# EAGLE board BasePCB (EAGLE 9.4.2), part 1 of 2
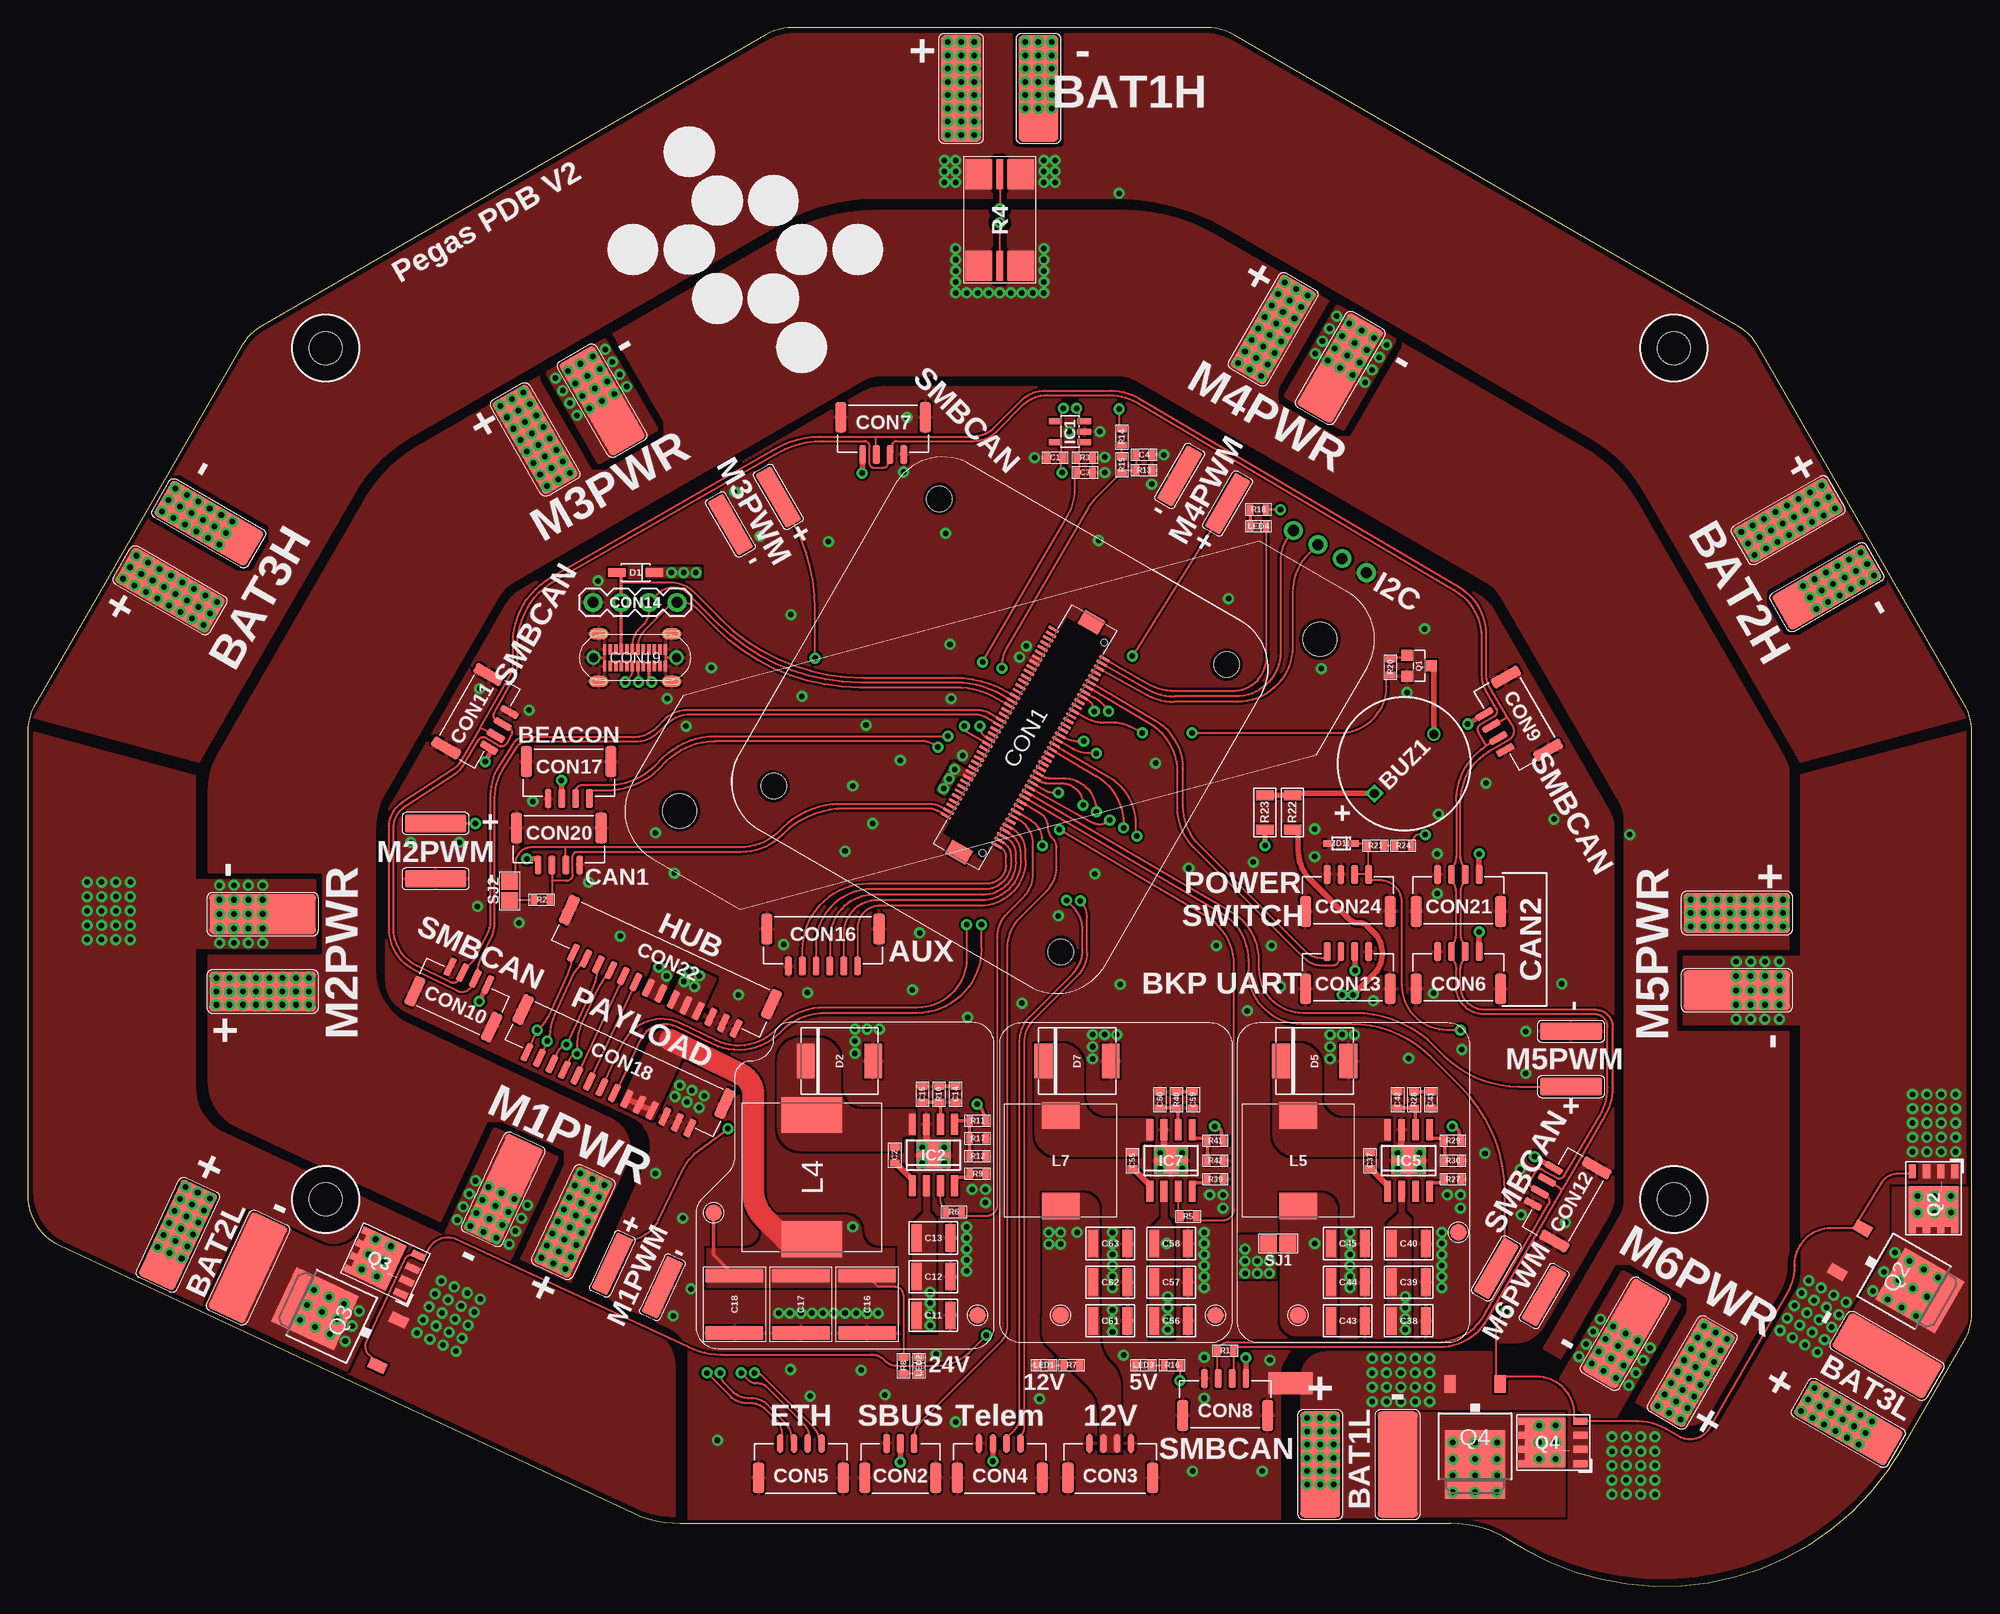
[diagram p3: board, top side]
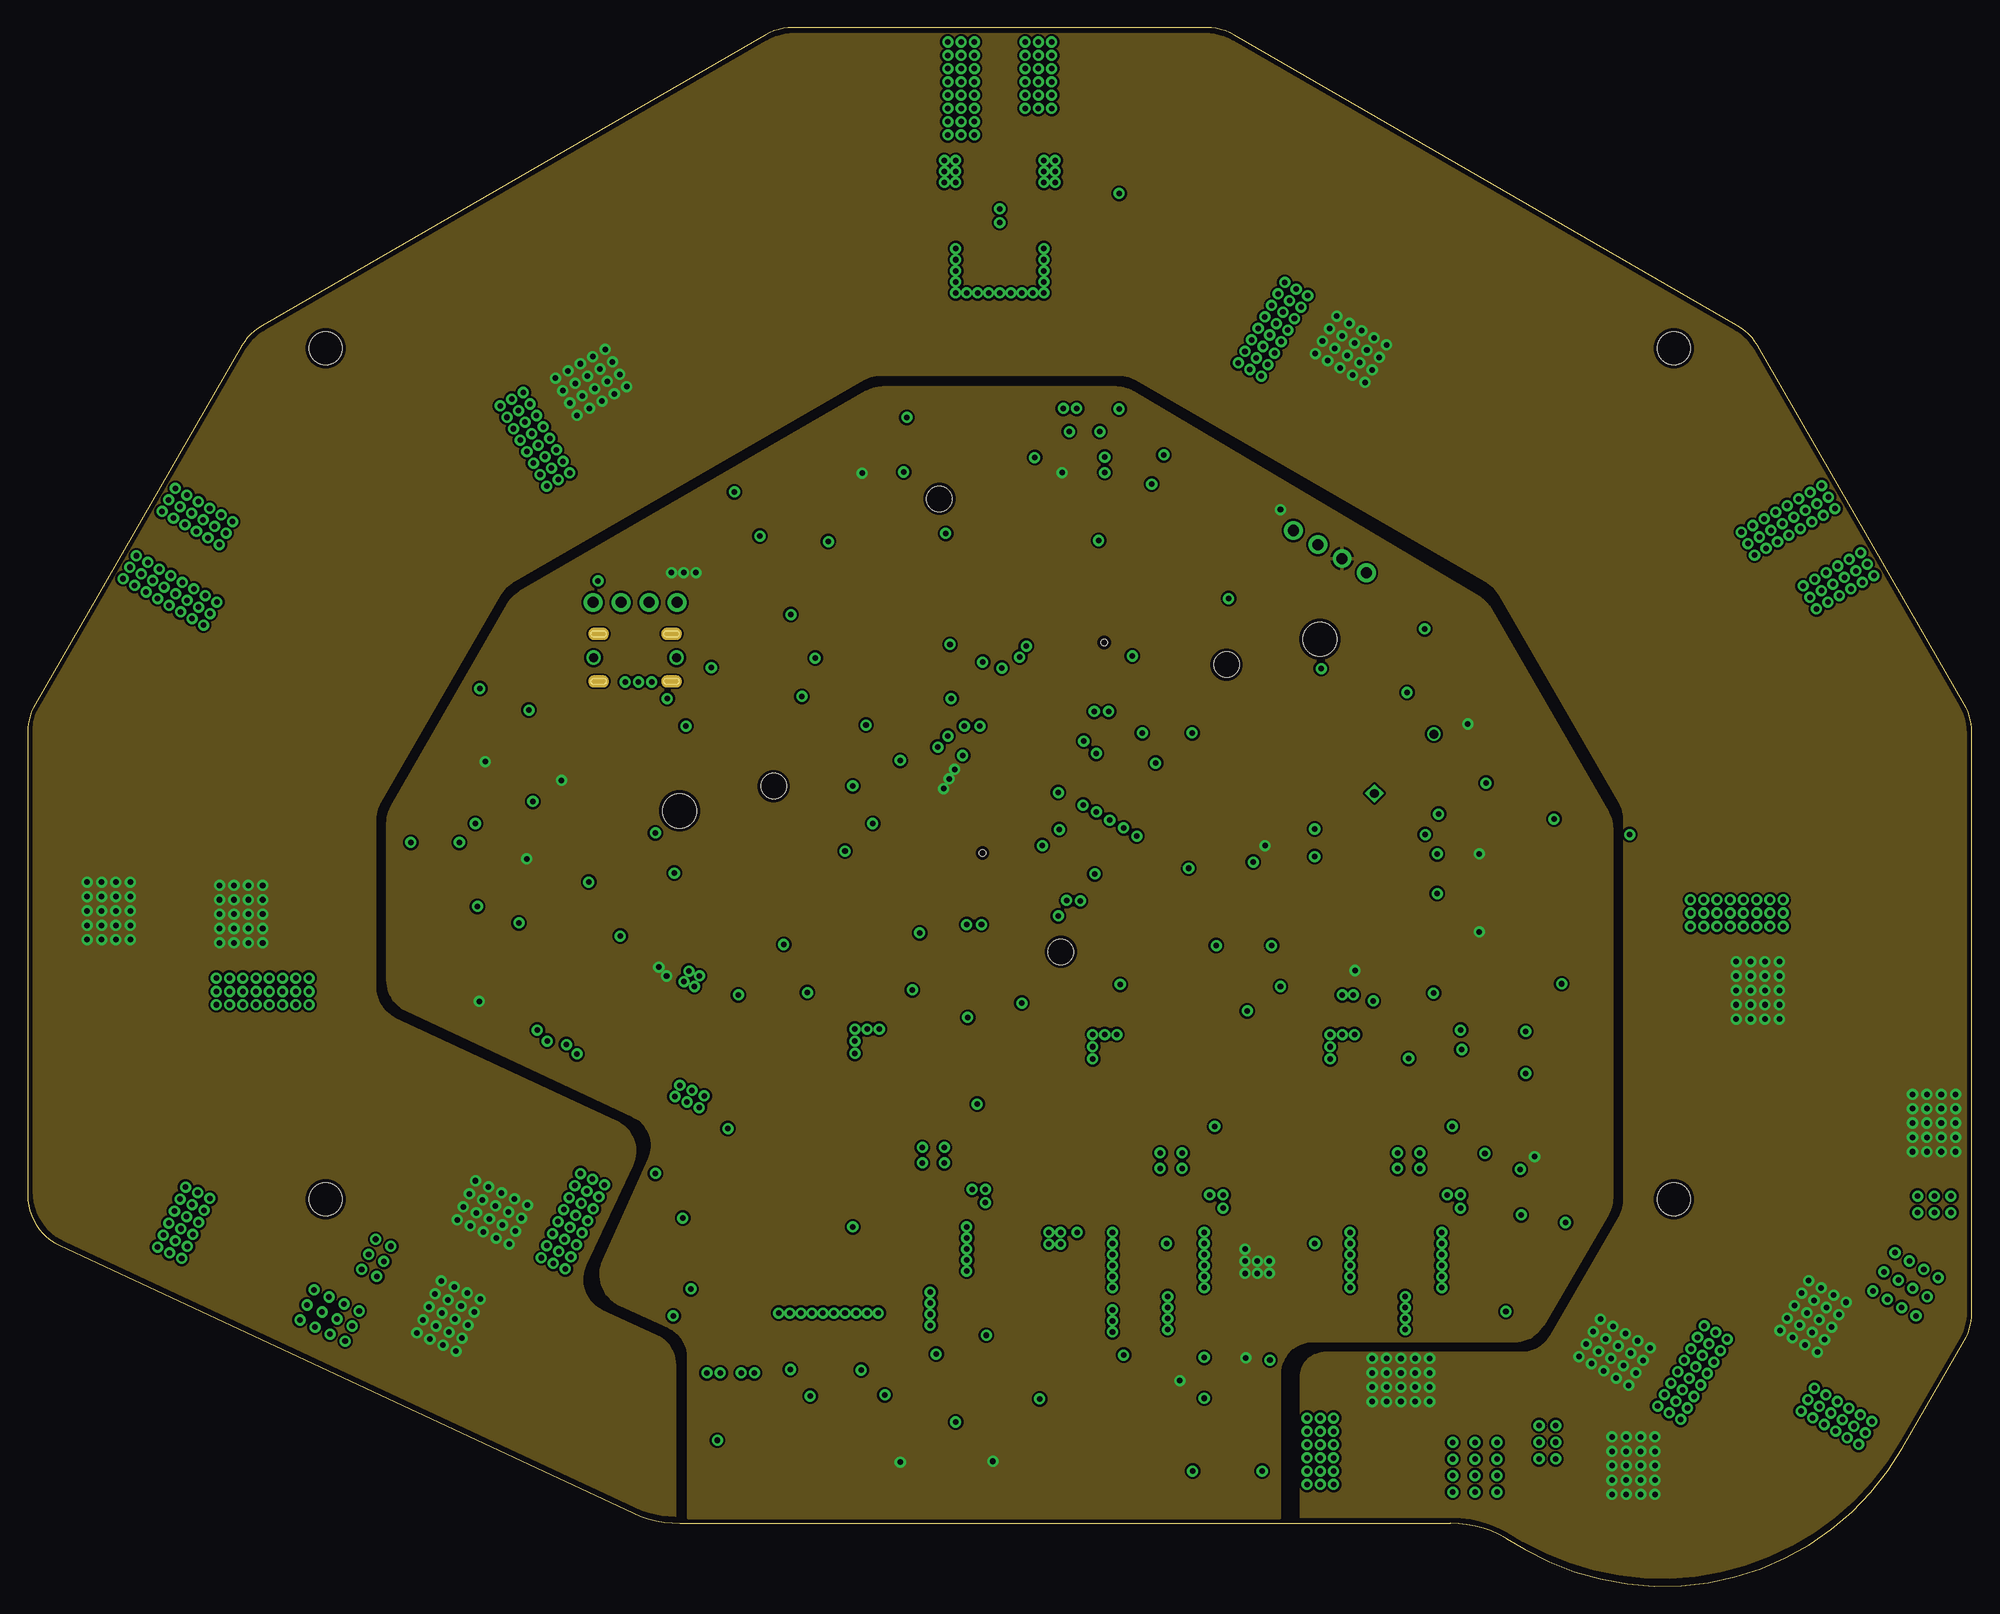
[diagram p4: board, inner layer Route2]
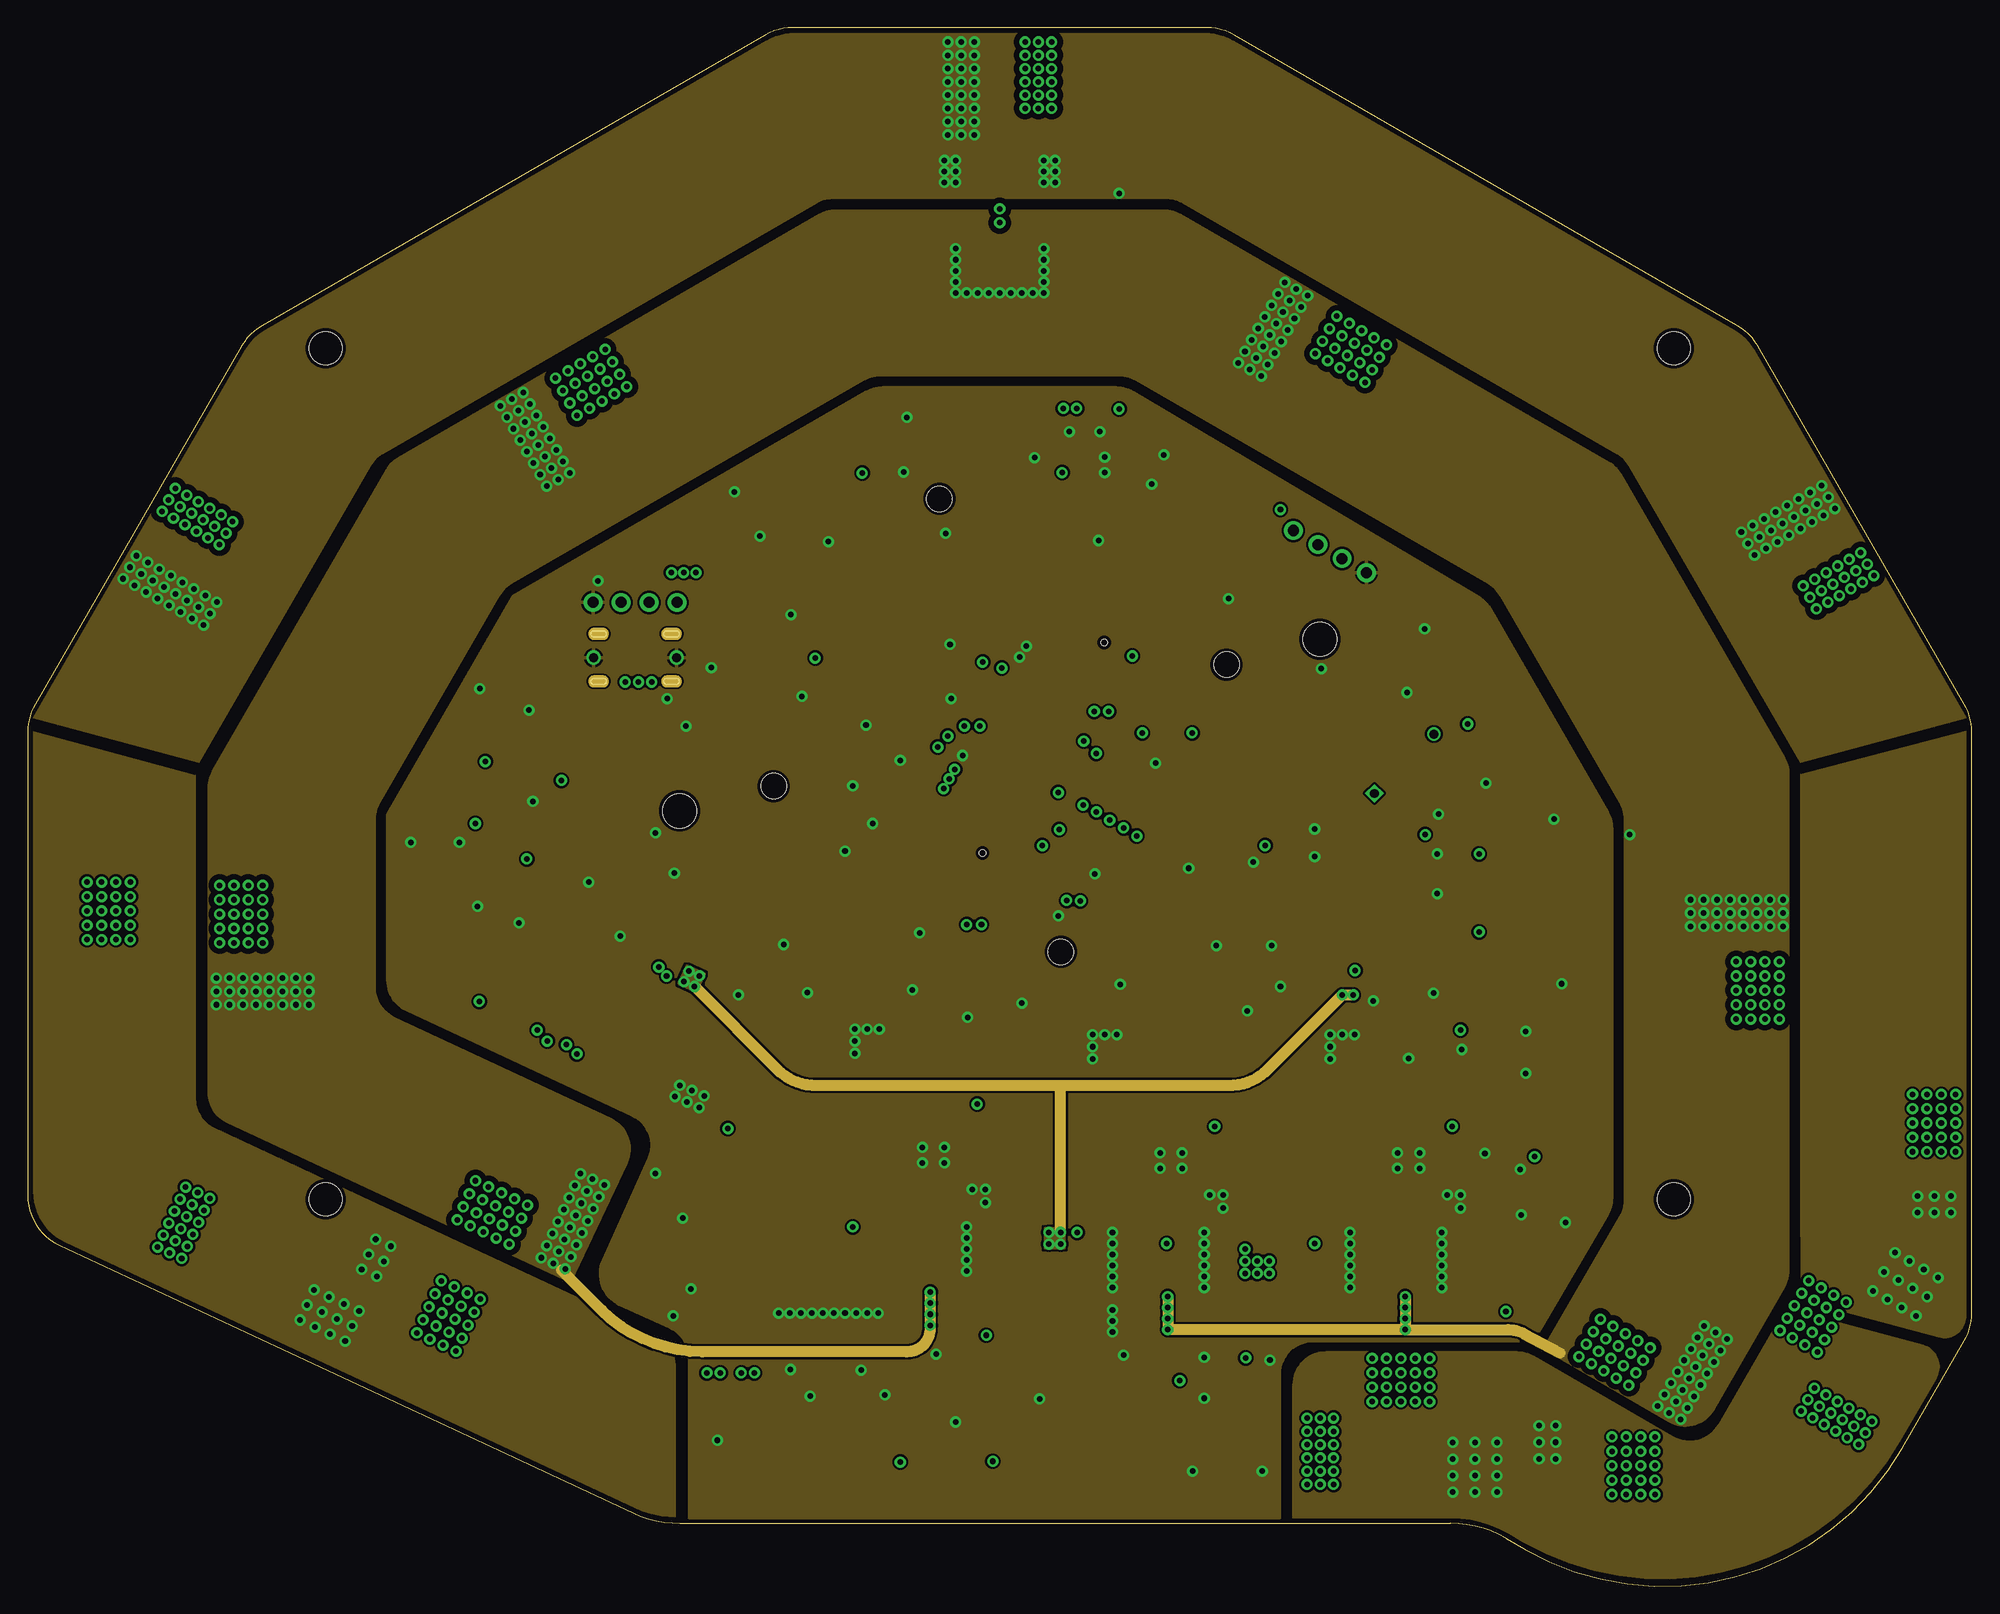
[diagram p5: board, inner layer Route3]
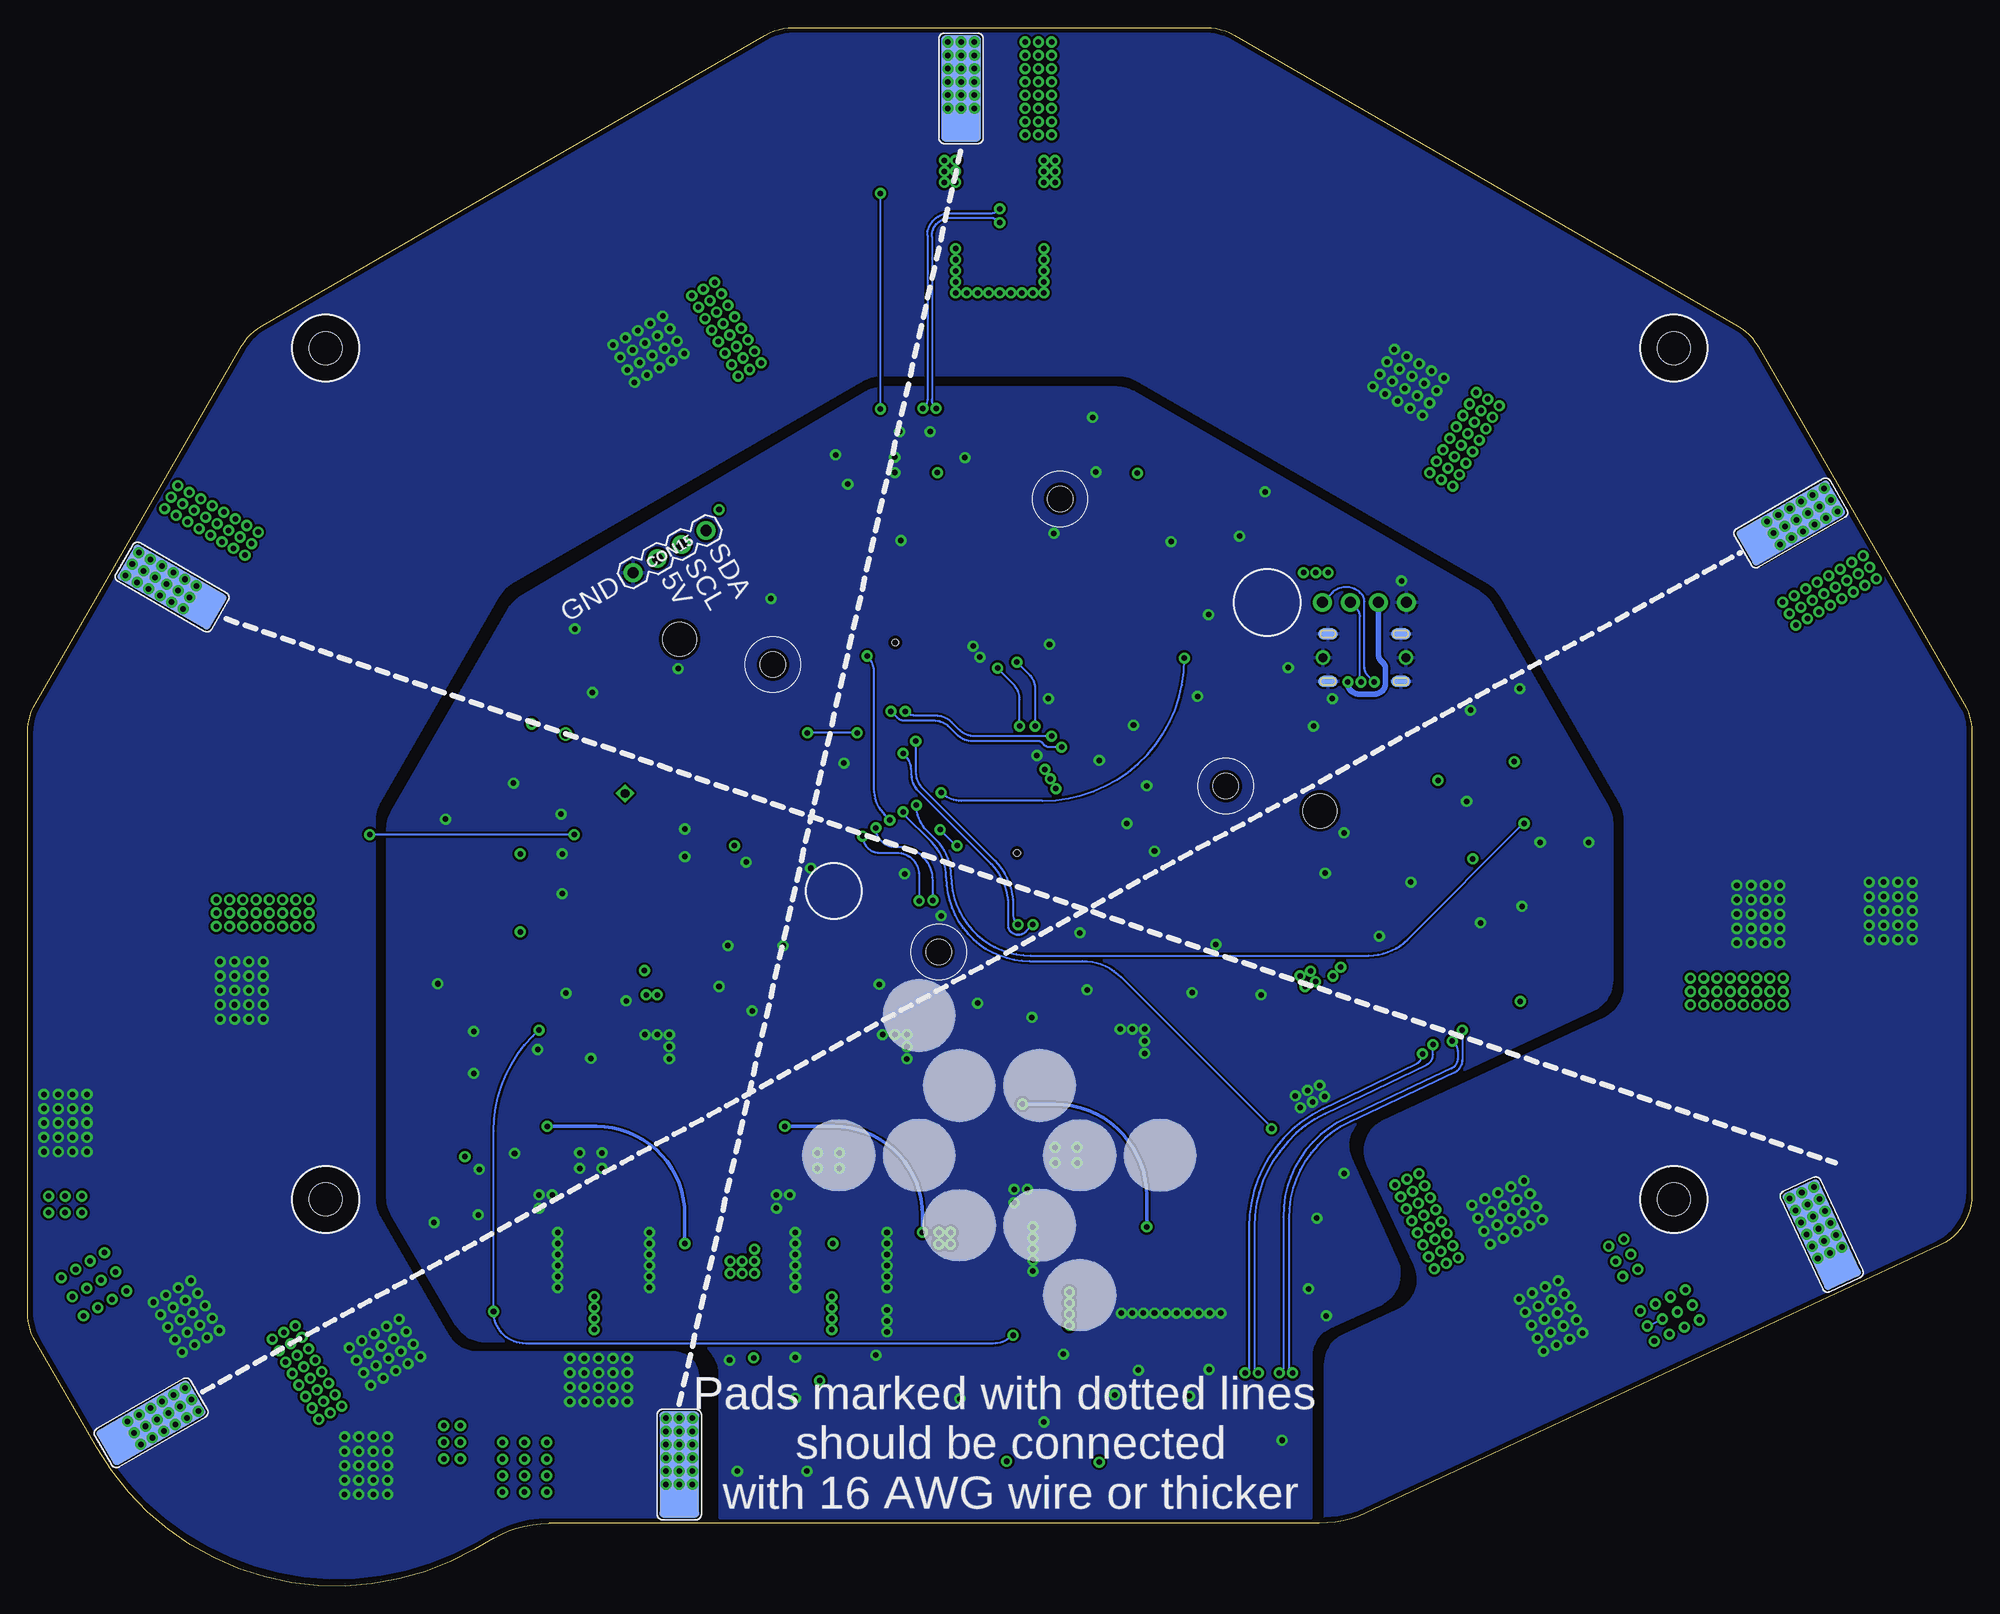
[diagram p6: board, bottom side, seen from below]

Size 175.94 x 140.99 mm. Coordinates in mm from the lower left corner, seen from the top.
Outline: 133.77,4.34 135.51,3.34 arc90 169.66,12.49 175.27,22.2 arc30 175.94,24.7 175.94,77.28 arc30 175.27,79.78 156.55,112.2 arc30 154.72,114.03 109.19,140.32 arc30 106.69,140.99 69.25,140.99 arc30 66.75,140.32 21.22,114.03 arc30 19.39,112.2 0.67,79.78 arc30 0,77.28 0,35.36 arc65 2.89,30.82 54.8,6.62 arc25 59.03,5.68 128.77,5.68 arc-30 133.77,4.34
Copper layers (1+2*3+16): Top 0.035mm / dielectric 0.12mm / Route2 0.035mm / dielectric 1.2mm / Route3 0.035mm / dielectric 0.2mm / Bottom 0.035mm
Design rules "JLCPCB 4 layer_0.2 *": minimum track width 0.2mm, minimum drill 0.2mm, track to track 0.2mm, track to pad 0.2mm, pad to pad 0.2mm, via to via 0.2mm, smd to smd 0.15mm, copper to edge 0.3mm, drill to drill 0.2mm, minimum pad ring 0.125mm, minimum via ring 0.125mm, stop-mask expansion 1mil, vias tented up to drill 0.5mm, thermal gap 8mil
Net classes: 1 HV: clearance 0.5 mm to class 0, clearance 0.5 mm
Holes 3 mm at 148.97,111.99 26.97,111.99 26.97,34.99 148.97,34.99
tRestrict: area 24,32 to 30,38; area 146,32 to 152,38; area 146,109 to 152,115; area 24,109 to 30,115; 3 lines
bRestrict: area 24,109 to 30,115; area 24,32 to 30,38; area 146,32 to 152,38; area 146,109 to 152,115

## Footprints (pad centres in the part's own frame; a part is rotated, then mirrored left to right if it is on the bottom)
4X10_PAIR = smd 3.6 x 9.6: 1 -3.5,0; 2 3.5,0
BUZZER_12MM = drill 0.8 pad 1.2 square: 1 -3.8,0 | drill 0.8 pad 1.2: 2 3.8,0
C0603 = smd 0.6 x 0.9: 1 -0.725,0; 2 0.725,0
C1210 = smd 0.9 x 2.5: 1 -1.55,0; 2 1.55,0
C2220 = smd 1.2 x 5.2: P$1 -2.6,0; P$2 2.6,0
CUBE_ORANGE = smd 0.25 x 1: 1 9.75,2.65; 2 9.75,-2.65; 3 9.25,2.65; 4 9.25,-2.65; 5 8.75,2.65; 6 8.75,-2.65; 7 8.25,2.65; 8 8.25,-2.65; 9 7.75,2.65; 10 7.75,-2.65; 11 7.25,2.65; 12 7.25,-2.65; 13 6.75,2.65; 14 6.75,-2.65; 15 6.25,2.65; 16 6.25,-2.65; 17 5.75,2.65; 18 5.75,-2.65; 19 5.25,2.65; 20 5.25,-2.65; 21 4.75,2.65; 22 4.75,-2.65; 23 4.25,2.65; 24 4.25,-2.65; 25 3.75,2.65; 26 3.75,-2.65; 27 3.25,2.65; 28 3.25,-2.65; 29 2.75,2.65; 30 2.75,-2.65; 31 2.25,2.65; 32 2.25,-2.65; 33 1.75,2.65; 34 1.75,-2.65; 35 1.25,2.65; 36 1.25,-2.65; 37 0.75,2.65; 38 0.75,-2.65; 39 0.25,2.65; 40 0.25,-2.65; 41 -0.25,2.65; 42 -0.25,-2.65; 43 -0.75,2.65; 44 -0.75,-2.65; 45 -1.25,2.65; 46 -1.25,-2.65; 47 -1.75,2.65; 48 -1.75,-2.65; 49 -2.25,2.65; 50 -2.25,-2.65; 51 -2.75,2.65; 52 -2.75,-2.65; 53 -3.25,2.65; 54 -3.25,-2.65; 55 -3.75,2.65; 56 -3.75,-2.65; 57 -4.25,2.65; 58 -4.25,-2.65; 59 -4.75,2.65; 60 -4.75,-2.65; 61 -5.25,2.65; 62 -5.25,-2.65; 63 -5.75,2.65; 64 -5.75,-2.65; 65 -6.25,2.65; 66 -6.25,-2.65; 67 -6.75,2.65; 68 -6.75,-2.65; 69 -7.25,2.65; 70 -7.25,-2.65; 71 -7.75,2.65; 72 -7.75,-2.65; 73 -8.25,2.65; 74 -8.25,-2.65; 75 -8.75,2.65; 76 -8.75,-2.65; 77 -9.25,2.65; 78 -9.25,-2.65; 79 -9.75,2.65; 80 -9.75,-2.65 | smd 1.4 x 2.1: P1 -12,0; P2 12,0 | hole 0.6: -11,-1.9; 11,-1.9 | hole 2.3: -15.2,17.5; 14.8,17.5; 14.8,-12.5; -15.2,-12.5
SM03B-GHS-TB = smd 0.6 x 1.7: 1 1.25,-2.91; 2 0,-2.91; 3 -1.25,-2.91 | smd 1 x 2.8: M$0 -3.2,0.19; M$1 3.2,0.19
SM04B-GHS-TB = smd 0.6 x 1.7: 1 1.875,-2.91; 2 0.625,-2.91; 3 -0.625,-2.91; 4 -1.875,-2.91 | smd 1 x 2.8: M$0 -3.825,0.19; M$1 3.825,0.19
BM04B-GHS-TB = smd 0.6 x 1.7: 1 -1.875,-2.9; 2 -0.625,-2.9; 3 0.625,-2.9; 4 1.875,-2.9 | smd 1 x 2.8: M$0 -3.825,0.45; M$1 3.825,0.45
1X04-PTH-2.54 = drill 1 pad 1.7: 1 -3.81,0; 2 -1.27,0; 3 1.27,0; 4 3.81,0
BM06B-GHS-TBT = smd 0.6 x 1.7: 1 -3.125,-2.9; 2 -1.875,-2.9; 3 -0.625,-2.9; 4 0.625,-2.9; 5 1.875,-2.9; 6 3.125,-2.9 | smd 1 x 2.8: M$0 -5.075,0.45; M$1 5.075,0.45
BM14B-GHS-TBT = smd 0.6 x 1.7: 1 -8.125,-2.9; 2 -6.875,-2.9; 3 -5.625,-2.9; 4 -4.375,-2.9; 5 -3.125,-2.9; 6 -1.875,-2.9; 7 -0.625,-2.9; 8 0.625,-2.9; 9 1.875,-2.9; 10 3.125,-2.9; 11 4.375,-2.9; 12 5.625,-2.9; 13 6.875,-2.9; 14 8.125,-2.9 | smd 1 x 2.8: M$0 -10.075,0.45; M$1 10.075,0.45
2047110001-PROD = smd 0.3 x 0.95: A1 -2.75,0.755; A2 -2.25,0.755; A3 -1.75,0.755; A4 -1.25,0.755; A5 -0.75,0.755; A6 -0.25,0.755; A7 0.25,0.755; A8 0.75,0.755; A9 1.25,0.755; A10 1.75,0.755; A11 2.25,0.755; A12 2.75,0.755; B1 2.75,-0.755; B2 2.25,-0.755; B3 1.75,-0.755; B4 1.25,-0.755; B5 0.75,-0.755; B6 0.25,-0.755; B7 -0.25,-0.755; B8 -0.75,-0.755; B9 -1.25,-0.755; B10 -1.75,-0.755; B11 -2.25,-0.755; B12 -2.75,-0.755 | smd 1.8 x 1: G1 -3.3,2.15; G4 3.3,2.15; G7 -3.3,-2.15; G9 3.3,-2.15 | smd 1.8 x 1 bottom: G2 -3.3,2.15; G5 3.3,2.15; G8 -3.3,-2.15; G10 3.3,-2.15 | drill 0.8 pad 1.3: P$1 -3.75,0; P$2 3.75,0
SOD123 = smd 1.6 x 0.8: A -1.7,0; C 1.7,0
DO-214AB(SMC) = smd 1.6 x 3.1: A 3.05,0; C -3.05,0
SOT23-5 = smd 1.2 x 0.55: 1 1.3,-0.95; 2 1.3,0; 3 1.3,0.95; 4 -1.3,0.95; 5 -1.3,-0.95
SOIC8-POWERPAD = smd 0.6 x 1.9: 1 -1.905,-2.78; 2 -0.635,-2.78; 3 0.635,-2.78; 4 1.905,-2.78; 5 1.905,2.78; 6 0.635,2.78; 7 -0.635,2.78; 8 -1.905,2.78 | smd 3.1 x 2.4: P$1 0,0
CONNECTION_BIG = smd 2 x 2: 1 -1,0; 2 1,0
MWSA1206S = smd 3.25 x 5.5: 1 -5.625,0; 2 5.625,0
1064 = smd 3.4 x 2.4: 1 0,-4.1; 2 0,4.1
LED0603 = smd 0.6 x 0.9: A 0.725,0; C -0.725,0
10X4 = smd 3.6 x 9.6: P$1 0,0
2х2 = smd 1.5 x 1.5: P$1 0,0
2X6_PAIR = smd 1.6 x 5.6: 1 -2.5,0; 2 2.5,0
SOT23 = smd 1 x 1: 1 1.1,-0.95; 2 1.1,0.95; 3 -1.1,0
D-PAK = smd 5.4 x 6.2: D 0,2.5 | smd 1 x 1.6: G -2.28,-4.8; S 2.28,-4.8
PG-TDSON-8 = smd 1.27 x 0.635: 1S -2.54,1.905; 2S -2.54,0.635; 3S -2.54,-0.635; 4G -2.54,-1.905 | smd 1.02 x 0.635: 5D 2.54,-1.905; 6D 2.54,-0.635; 7D 2.54,0.635; 8D 2.54,1.905 | smd 3.678 x 4.445: PAD_D 0.66,-0.003
R0603 = smd 0.6 x 0.9: 1 -0.725,0; 2 0.725,0
R3920-KELVIN = smd 2.7 x 2.4: 1 -4.15,1.9; 2 4.15,1.9; 11 -4.15,-1.9; 22 4.15,-1.9 | smd 2.7 x 0.6: S1 -4.15,0; S2 4.15,0
R1206 = smd 0.9 x 1.6: P$1 -1.55,0; P$2 1.55,0
RES_0 = smd 1.5 x 1.5: 1 -0.85,0; 2 0.85,0
CUBE_MOUNT = hole 3.1: -30,0; 30,0
SOD323 = smd 1 x 0.6: A 1.1,0; C -1.1,0

## Placement (x,y rotation side)
BAT1PAD1  PAD_PAIR-4X10  [4X10_PAIR]  87.97,135.49 0 top
BAT1PAD2  PAD_PAIR-4X10  [4X10_PAIR]  120.47,10.99 0 top
BAT2PAD1  PAD_PAIR-4X10  [4X10_PAIR]  161.06,93.4 300 top
BAT2PAD2  PAD_PAIR-4X10  [4X10_PAIR]  16.77,30.29 335 top
BAT3PAD1  PAD_PAIR-4X10  [4X10_PAIR]  14.64,93.12 60 top
BAT3PAD2  PAD_PAIR-4X10  [4X10_PAIR]  166.51,17.8 60 top
BUZ1  BUZZER-ЕР-12MM  [BUZZER_12MM]  124.57,74.39 45 top
C1  0.1uF  [C0603]  92.97,102.09 0 top
C2  0.1uF  [C0603]  78.47,38.99 90 top
C3  DNP  [C0603]  95.67,100.74 180 top
C4  DNP  [C0603]  101.02,102.34 180 top
C11  2.2uF  [C1210]  81.97,24.49 180 top
C12  2.2uF  [C1210]  81.97,27.99 180 top
C13  2.2uF  [C1210]  81.97,31.49 180 top
C14  4700pF  [C0603]  83.97,44.49 90 top
C15  47pF  [C0603]  80.97,44.49 270 top
C16  22uF  [C2220]  75.97,25.49 90 top
C17  22uF  [C2220]  69.97,25.49 90 top
C18  22uF  [C2220]  63.97,25.49 90 top
C37  0.1uF  [C0603]  121.47,38.49 90 top
C38  2.2uF  [C1210]  124.97,23.99 180 top
C39  2.2uF  [C1210]  124.97,27.49 180 top
C40  2.2uF  [C1210]  124.97,30.99 180 top
C41  4700pF  [C0603]  126.97,43.99 90 top
C42  47pF  [C0603]  123.97,43.99 270 top
C43  47uF  [C1210]  119.47,23.99 180 top
C44  47uF  [C1210]  119.47,27.49 180 top
C45  47uF  [C1210]  119.47,30.99 180 top
C55  0.1uF  [C0603]  99.97,38.49 90 top
C56  2.2uF  [C1210]  103.47,23.99 180 top
C57  2.2uF  [C1210]  103.47,27.49 180 top
C58  2.2uF  [C1210]  103.47,30.99 180 top
C59  4700pF  [C0603]  105.47,43.99 90 top
C60  47pF  [C0603]  102.47,43.99 270 top
C61  47uF  [C1210]  97.97,23.99 180 top
C62  47uF  [C1210]  97.97,27.49 180 top
C63  47uF  [C1210]  97.97,30.99 180 top
CON1  CUBE_ORANGE_  [CUBE_ORANGE]  90.27,76.79 60 top
CON2  CON-3P-TABS-JST-GH-SIDE  [SM03B-GHS-TB]  78.97,9.99 180 top
CON3  CON-4P-TABS-JST-GH-SIDE  [SM04B-GHS-TB]  97.97,9.99 180 top
CON4  CON-4P-TABS-JST-GH-SIDE  [SM04B-GHS-TB]  87.97,9.99 180 top
CON5  CON-4P-TABS-JST-GH-SIDE  [SM04B-GHS-TB]  69.97,9.99 180 top
CON6  CON-4P-TABS-JST-GH-TOP  [BM04B-GHS-TB]  129.47,54.49 180 top
CON7  CON-4P-TABS-JST-GH-TOP  [BM04B-GHS-TB]  77.42,105.29 0 top
CON8  CON-4P-TABS-JST-GH-TOP  [BM04B-GHS-TB]  108.37,15.89 180 top
CON9  CON-4P-TABS-JST-GH-TOP  [BM04B-GHS-TB]  135.29,78.71 300 top
CON10  CON-4P-TABS-JST-GH-TOP  [BM04B-GHS-TB]  38.71,52.61 155 top
CON11  CON-4P-TABS-JST-GH-TOP  [BM04B-GHS-TB]  40.17,78.92 60 top
CON12  CON-4P-TABS-JST-GH-TOP  [BM04B-GHS-TB]  139.67,34.74 240 top
CON13  CON-4P-TABS-JST-GH-TOP  [BM04B-GHS-TB]  119.47,54.49 180 top
CON14  PINHEAD_1X04-2.54  [1X04-PTH-2.54]  54.97,88.99 0 top
CON15  PINHEAD_1X04-2.54  [1X04-PTH-2.54]  117.85,93.59 30 bottom
CON16  CON-6P-TABS-JST-GH-TOP  [BM06B-GHS-TBT]  71.97,58.99 0 top
CON17  CON-4P-TABS-JST-GH-TOP  [BM04B-GHS-TB]  48.97,74.14 0 top
CON18  CON-14P-TABS-JST-GH-TOP  [BM14B-GHS-TBT]  53.77,47.49 335 top
CON19  USB-TYPE-C-VERT-PROD  [2047110001-PROD]  54.97,83.99 0 top
CON20  CON-4P-TABS-JST-GH-TOP  [BM04B-GHS-TB]  48.07,68.14 0 top
CON21  CON-4P-TABS-JST-GH-TOP  [BM04B-GHS-TB]  129.47,61.49 180 top
CON22  CON-14P-TABS-JST-GH-TOP  [BM14B-GHS-TBT]  57.97,56.49 335 top
CON24  CON-4P-TABS-JST-GH-TOP  [BM04B-GHS-TB]  119.47,61.49 180 top
D1  MBR0520L-SOD123  [SOD123]  55.02,91.69 0 top
D2  B560C  [DO-214AB(SMC)]  73.47,47.49 0 top
D5  B560C  [DO-214AB(SMC)]  116.47,47.49 0 top
D7  B560C  [DO-214AB(SMC)]  94.97,47.49 0 top
IC1  INA169  [SOT23-5]  94.32,104.44 0 top
IC2  TPS54560B  [SOIC8-POWERPAD]  81.97,38.99 0 top
IC5  TPS54560B  [SOIC8-POWERPAD]  124.97,38.49 0 top
IC7  TPS54560B  [SOIC8-POWERPAD]  103.47,38.49 0 top
J1  CONNECTION-SMD-BIG  [CONNECTION_BIG]  114.27,18.34 0 top
L4  22µH  [MWSA1206S]  70.97,36.99 270 top
L5  7.2uH  [1064]  114.97,38.49 180 top
L7  7.2uH  [1064]  93.47,38.49 180 top
LED1  LED-0603  [LED0603]  91.97,19.99 0 top
LED2  LED-0603  [LED0603]  80.67,19.94 270 top
LED3  LED-0603  [LED0603]  100.97,19.99 0 top
LED4  LED-0603  [LED0603]  111.37,95.89 180 top
M1  PAD_PAIR-4X10  [4X10_PAIR]  46.21,34.41 155 top
M2  PAD_PAIR-4X10  [4X10_PAIR]  21.27,57.29 90 top
M3  PAD_PAIR-4X10  [4X10_PAIR]  48.96,105.49 30 top
M4  PAD_PAIR-4X10  [4X10_PAIR]  115.74,111.94 330 top
M5  PAD_PAIR-4X10  [4X10_PAIR]  154.67,57.39 270 top
M6  PAD_PAIR-4X10  [4X10_PAIR]  147.61,21.08 150 top
PAD1  PAD-10X4  [10X4]  91.47,135.49 0 bottom
PAD2  PAD-10X4  [10X4]  13.6,31.8 25 bottom
PAD5  PAD-10X4  [10X4]  162.86,90.38 240 bottom
PAD6  PAD-10X4  [10X4]  164.76,14.77 300 bottom
PAD7  PAD-10X4  [10X4]  116.97,10.99 0 bottom
PAD10  PAD-10X4  [10X4]  16.39,96.18 300 bottom
PAD13  PAD-S_2X2  [2х2]  129.47,31.99 90 top
PAD14  PAD-S_2X2  [2х2]  114.97,24.49 90 top
PAD15  PAD-S_2X2  [2х2]  93.47,24.49 90 top
PAD16  PAD-S_2X2  [2х2]  107.47,24.49 180 top
PAD17  PAD-S_2X2  [2х2]  62.07,33.79 180 top
PAD18  PAD-S_2X2  [2х2]  85.97,24.49 90 top
PAD28  PAD_PAIR-2X6  [2X6_PAIR]  55.17,28.09 155 top
PAD29  PAD_PAIR-2X6  [2X6_PAIR]  36.92,66.49 90 top
PAD30  PAD_PAIR-2X6  [2X6_PAIR]  65.77,97.29 30 top
PAD31  PAD_PAIR-2X6  [2X6_PAIR]  106.42,99.19 330 top
PAD32  PAD_PAIR-2X6  [2X6_PAIR]  139.67,47.69 270 top
PAD33  PAD_PAIR-2X6  [2X6_PAIR]  135.07,27.49 150 top
Q1  IRLML0030  [SOT23]  125.92,83.24 180 top
Q2  IRFR2407PBF  [D-PAK]  169.07,27.99 240 top
Q2_  IRFH5010TRPBF-DFN5X6  [PG-TDSON-8]  172.47,34.99 270 top
Q3  IRFR2407PBF  [D-PAK]  28.27,24.04 65 top
Q3_  IRFH5010TRPBF-DFN5X6  [PG-TDSON-8]  32.27,29.25 155 top
Q4  IRFR2407PBF  [D-PAK]  130.97,13.49 180 top
Q4_  IRFH5010TRPBF-DFN5X6  [PG-TDSON-8]  137.97,12.99 180 top
R1  120R  [R0603]  108.37,21.29 180 top
R2  120R  [R0603]  46.52,62.09 180 top
R3  82K  [R0603]  95.67,102.09 180 top
R4  200 µOhms  [R3920-KELVIN]  87.97,123.59 270 top
R5  DNP  [R0603]  105.02,33.44 180 top
R6  DNP  [R0603]  83.82,33.84 180 top
R7  3K3  [R0603]  94.47,19.99 180 top
R8  7K5  [R0603]  79.27,19.94 270 top
R9  243K  [R0603]  85.97,37.29 180 top
R10  16K  [R0603]  82.47,44.49 270 top
R11  143K  [R0603]  85.97,42.09 0 top
R12  10K2  [R0603]  85.97,38.89 180 top
R13  10K2  [R0603]  101.02,100.94 180 top
R14  82K  [R0603]  99.02,103.94 90 top
R15  82K  [R0603]  99.02,101.44 90 top
R16  1K  [R0603]  103.57,19.99 180 top
R17  10K2  [R0603]  85.97,40.49 180 top
R18  1K  [R0603]  111.37,97.39 180 top
R20  200R  [R0603]  123.32,83.14 270 top
R21  143K  [R0603]  121.97,66.99 180 top
R22  200R  [R1206]  114.47,69.99 270 top
R23  DNM  [R1206]  111.97,69.99 270 top
R24  143K  [R0603]  124.47,66.99 180 top
R27  243K  [R0603]  128.97,36.79 180 top
R28  16K  [R0603]  125.47,43.99 270 top
R29  53K6  [R0603]  128.97,40.29 0 top
R30  10K2  [R0603]  128.97,38.49 180 top
R39  243K  [R0603]  107.47,36.79 180 top
R40  16K  [R0603]  103.97,43.99 270 top
R41  143K  [R0603]  107.47,40.29 0 top
R42  10K2  [R0603]  107.47,38.49 180 top
SJ1  [RES_0]  113.17,30.99 180 top
SJ2  [RES_0]  43.62,62.89 90 top
U$1  [AERODYNE]  87.97,38.99 0 bottom
U$2  [AERODYNE_SMALL]  64.97,120.99 0 top
U$3  [CUBE_MOUNT]  87.97,77.89 195 top
ZD1  MM3Z12VBW  [SOD323]  118.87,67.19 180 top